# Altium project NacelleV2shop.PrjPcb
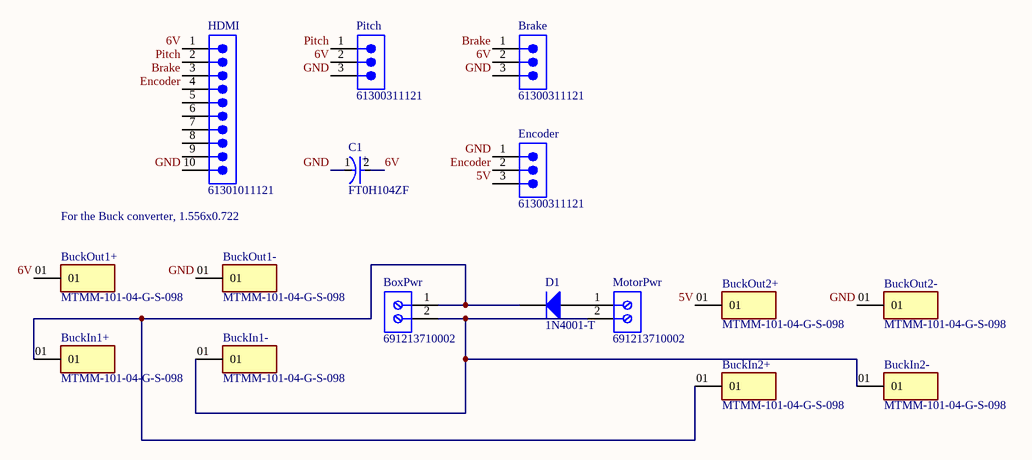
[diagram p0: NacelleV2.SchDoc]
1 sheet, 16 parts. Net scope: global (net labels, ports and power ports of the same name join across sheets).
Board file: NacelleV2.2.PcbDoc

## Sheet NacelleV2.SchDoc
size A; SheetNumber: 1; SheetTotal: 1

### Parts
BoxPwr  691213710002  [691213710002]
Brake  61300311121  [61300311121]
BuckIn1+  MTMM-101-04-G-S-098  [SAMTEC_MTMM-101-04-G-S-098]
BuckIn1-  MTMM-101-04-G-S-098  [SAMTEC_MTMM-101-04-G-S-098]
BuckIn2+  MTMM-101-04-G-S-098  [SAMTEC_MTMM-101-04-G-S-098]
BuckIn2-  MTMM-101-04-G-S-098  [SAMTEC_MTMM-101-04-G-S-098]
BuckOut1+  MTMM-101-04-G-S-098  [SAMTEC_MTMM-101-04-G-S-098]
BuckOut1-  MTMM-101-04-G-S-098  [SAMTEC_MTMM-101-04-G-S-098]
BuckOut2+  MTMM-101-04-G-S-098  [SAMTEC_MTMM-101-04-G-S-098]
BuckOut2-  MTMM-101-04-G-S-098  [SAMTEC_MTMM-101-04-G-S-098]
C1  FT0H104ZF  [FP-FT0H104ZF-MFG]
D1  1N4001-T  [DIOD-DO-41-P-2_V]
Encoder  61300311121  [61300311121]
HDMI  61301011121  [61301011121]
MotorPwr  691213710002  [691213710002]
Pitch  61300311121  [61300311121]

### Nets
5V: BuckOut2+.01 Encoder.3
6V: Brake.2 BuckOut1+.01 C1.2(A) HDMI.1 Pitch.2
Brake: Brake.1 HDMI.3
Encoder: Encoder.2 HDMI.4
GND: Brake.3 BuckOut1-.01 BuckOut2-.01 C1.1(C) Encoder.1 HDMI.10 Pitch.3
Pitch: HDMI.2 Pitch.1
NetBoxPwr_1: BoxPwr.1 BuckIn1+.01 BuckIn2+.01 D1.2(K)
NetBoxPwr_2: BoxPwr.2 BuckIn1-.01 BuckIn2-.01 MotorPwr.2
NetD1_1: D1.1(A) MotorPwr.1

Not connected (* = marked no-connect by the designer): HDMI 5 6 7 8 9

### Notes on the sheet
- For the Buck converter, 1.556x0.722
- (in symbol CMP-03024-000005-1) +

### Library data of the parts
BoxPwr MotorPwr = CMP-1502-02526-2: NexarPartId: 8917718; Number of Contacts: 2; Current Rating: 10A; Stripping Length: -7mm; Wire Gauge (Max): 26AWG; Plating: Brass, Steel; Wire Gauge (Min): 16AWG; Voltage: 300V; Number of Levels: 1; Pitch: 5.0038mm; Color: Green; Number of Pins: 2; Housing Material: Nylon; Termination: Screw; Max Operating Temperature: 105°C; Min Operating Temperature: -40°C; Packaging: Box; Current: 10A; REACH SVHC: Unknown; Width: 10.6mm; RoHS: Compliant; Mount: Through Hole; Height: 10mm; Contact Material: Brass; Length: 8.3mm; Lead Pitch: 5mm; Wire/Cable Gauge: 26AWG; Voltage Rating: 300V; Number of Positions Per Level: 2; Contact Plating: Tin
Brake Encoder Pitch = CMP-1502-01062-3: NexarPartId: 32855521; Current Rating: 3A; Voltage Rating: 250V; Number of Positions: 3; Pitch: 2.54mm; Contact Resistance: 20mΩ; Connector Type: Male Pin; Gender: Male; REACH SVHC: Unknown; Packaging: Bulk; Contact Material: Copper; Min Operating Temperature: -40°C; Number of Rows: 1; Orientation: Vertical; RoHS: Compliant; Contact Plating: Gold; Max Operating Temperature: 105°C; Mount: Through Hole; Height: 8.94mm; Operating Supply Voltage: 250V; Number of Pins: 3; Contact Mating Length: 5.9944mm; Number of Contacts: 3; Color: Black; Lead Free: Lead Free; Lead Pitch: 2.54mm; Termination: Solder
BuckIn1+ BuckIn1- BuckIn2+ BuckIn2- BuckOut1+ BuckOut1- BuckOut2+ BuckOut2- = MTMM-101-04-G-S-098: Connector Header Through Hole 1 position -; MF: Samtec; SnapEDA_Link: https://www.snapeda.com/parts/MTMM-101-04-G-S-098/Samtec/view-part/?ref=snap; Package: None; Value: *; MP: MTMM-101-04-G-S-098; Check_prices: https://www.snapeda.com/parts/MTMM-101-04-G-S-098/Samtec/view-part/?ref=eda
C1 = CMP-03024-000005-1: CAP 100MF -20% +80% 5.5V T/H; Manufacturer: KEMET; Value: 0.1F; Tolerance: +80/-20%; Automotive: No; RoHS: TRUE; Octopart: https://octopart.com/ft0h104zf-kemet-30531663; Voltage Rating: 5.5V; Device Class L2: Capacitors; Manufacturer Part Number: FT0H104ZF; Temperature Range Low: -40°C; Package: FT0H104ZF; Device Class L1: Passive Components; Lead Free: Yes; Temperature Range High: +85°C; Digikey Description: CAP 100MF -20% +80% 5.5V T/H; ComponentLink2URL: https://content.kemet.com/datasheets/KEM_S6014_FT.pdf; Temperature: -40°C to +85°C; Mouser Description: Super Capacitor Capacitance tolerance: -20/+80% Capacitance: 0.1 F Rated voltage: 5.5 VDC; Ipc Land Pattern Name: CAPRD508W155D1150H850; Capacitance: 0.1F; Device Class L3: Supercapacitors; Category: Cap; ComponentLink2Description: Datasheet; Height: 8.5mm
D1 = CMP-0639-00006-2: 1.0 A Rectifier, 15 pF, 50 V, -65 to 150 degC, 2-Pin DO-41 Plastic, RoHS, Tape and Reel; Manufacturer: Diodes Inc; VF (V): 1; CT (pF): 15; Max. IR (uA): 5; VRRM (V): 50; Max. IFSM (A): 30; RoHS: TRUE; Mounting Technology: Through Hole; PartNumber: 1N4001-T; ComponentLink2Description: Datasheet; DatasheetVersion: Rev. 8-2; Operating Temperature Range (degC): -65 to 150; Packing: Tape and Reel; PackageReference: DO-41-P-2; ComponentLink1URL: http://diodes.com/; PackageDescription: 2-Pin Axial Lead, Body 4.635 x 2.36 mm, Lead Spread 25.4 mm; ComponentLink2URL: http://diodes.com/datasheets/ds28002.pdf; Max. Average Rectified Current IO (A): 1; ComponentLink1Description: Manufacturer URL
HDMI = CMP-1502-01082-5: NexarPartId: 18818159; Gender: Male; Number of Positions: 10; Operating Supply Voltage: 250V; Current Rating: 3A; Contact Resistance: 20mΩ; Connector Type: Male Pin; Insulation Resistance: 1GΩ; Pitch: 2.54mm; Color: Black; Contact Gender: Male; Height: 8.74mm; Orientation: Vertical; RoHS: Compliant; Packaging: Bulk; Min Operating Temperature: -40°C; Number of Pins: 10; Max Operating Temperature: 105°C; REACH SVHC: Unknown; Voltage Rating: 250V; Number of Rows: 1; Housing Material: PBT; Number of Contacts: 10; Mount: Through Hole; Contact Mating Length: 5.9944mm; Length: 2.54mm; Lead Pitch: 2.54mm; Flammability Rating: UL94 V-0; Termination: Solder; Contact Material: Copper; Width: 25.4mm; Contact Plating: Gold